# Altium schematic sheet Meter13050.SchDoc
size A4
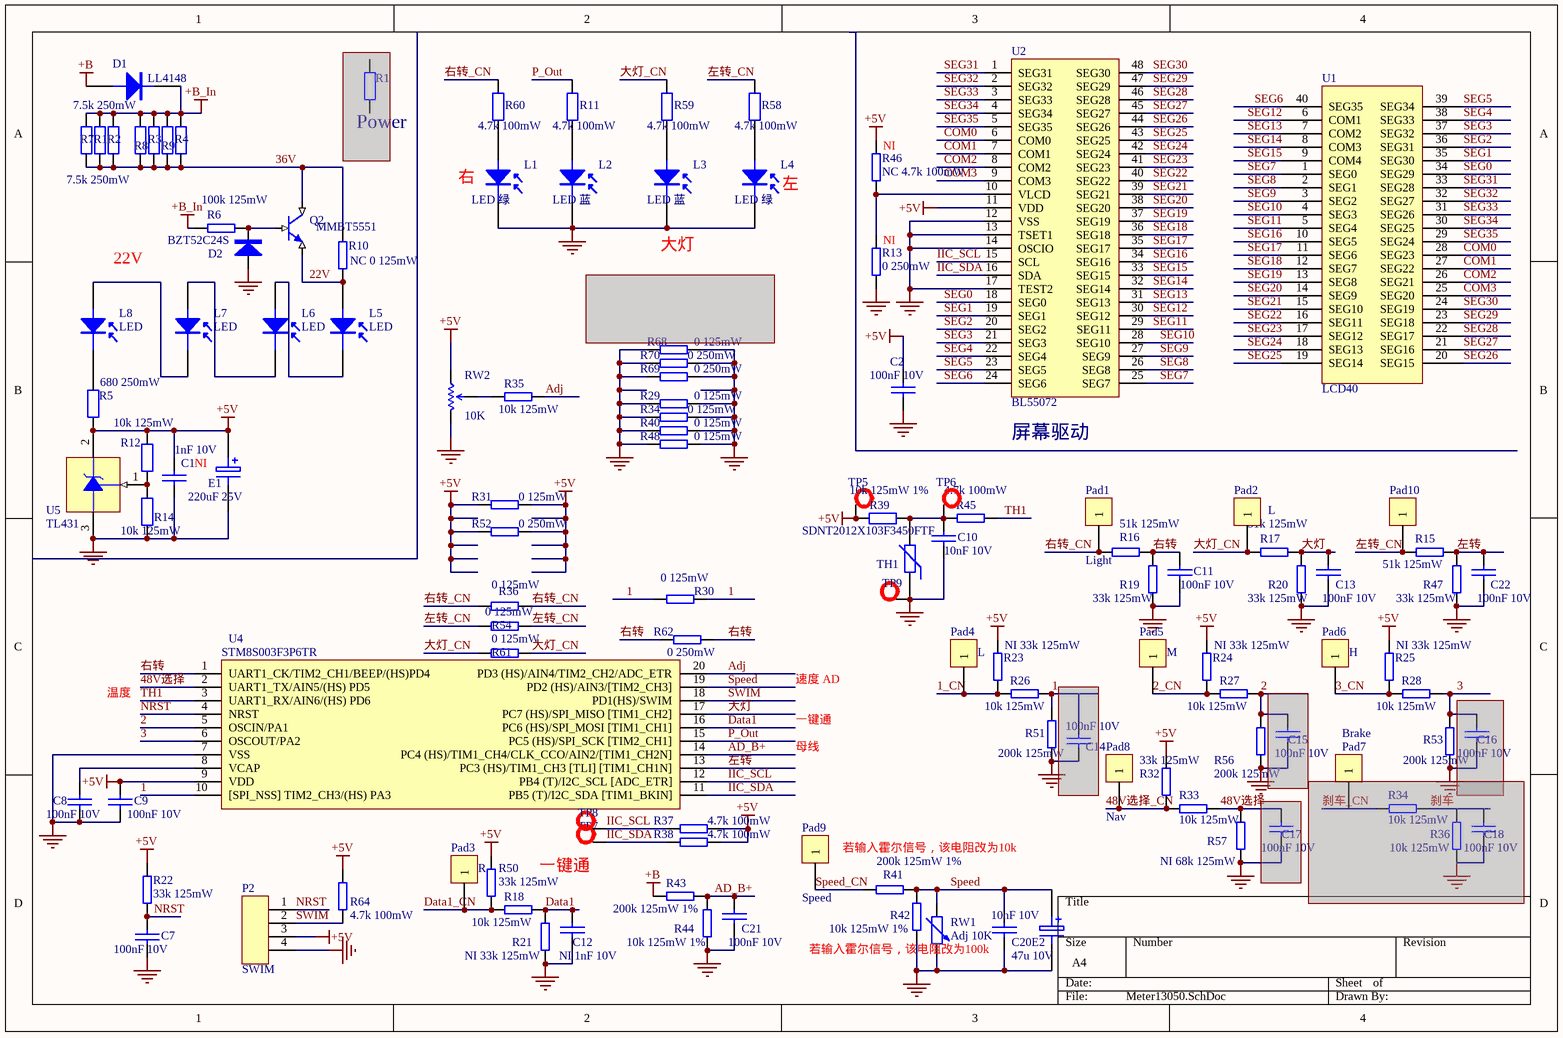
[diagram p0: Meter13050.SchDoc]

## Parts
(Parts that share a designator on the sheet are numbered #1, #2 ... from top to bottom, then left to right.)
C1  1nF 10V  [0805]
C2  100nF 10V  [0603]
C7  100nF 10V  [0805]
C8  100nF 10V  [0603]
C9  100nF 10V  [0603]
C10  10nF 10V  [0603]
C11  100nF 10V  [0603]
C12  NI 1nF 10V  [0805]
C13  100nF 10V  [0603]
C14  100nF 10V  [0805]  (masked out: inside a compile mask, not in the netlist)
C15  100nF 10V  [0805]  (masked out: inside a compile mask, not in the netlist)
C16  100nF 10V  [0805]  (masked out: inside a compile mask, not in the netlist)
C17  100nF 10V  [0805]  (masked out: inside a compile mask, not in the netlist)
C18  100nF 10V  [0603]  (masked out: inside a compile mask, not in the netlist)
C20  10nF 10V  [0603]
C21  100nF 10V  [0603]
C22  100nF 10V  [0603]
D1  LL4148  [MELF-D3516-1406]
D2  BZT52C24S  [SOD-323]
E1  220uF 25V  [RB.1/.2]
E2  47u 10V  [RB.1/.2]
L1  LED 绿  [LED1]
L2  LED 蓝  [LED1]
L3  LED 蓝  [LED1]
L4  LED 绿  [LED1]
L5  LED  [LED1]
L6  LED  [LED1]
L7  LED  [LED1]
L8  LED  [LED1]
P2  SWIM  [SIP4]
Pad1  Light  [PAD]
Pad2  L  [PAD]
Pad3  R  [PAD]
Pad4  L  [PAD]
Pad5  M  [PAD]
Pad6  H  [PAD]
Pad7  Brake  [PAD]  (masked out: inside a compile mask, not in the netlist)
Pad8  Nav  [PAD]
Pad9  Speed  [PAD]
Pad10  (no value)  [PAD]
Q2  MMBT5551  [SOT-23]
R1#1  3.9k 1W  [RES12.5-10.5X3.3]  (value not drawn)  (masked out: inside a compile mask, not in the netlist)
R1#2  7.5k 250mW  [1206]
R2  7.5k 250mW  [1206]  (value not drawn)
R3  7.5k 250mW  [1206]  (value not drawn)
R4  7.5k 250mW  [1206]  (value not drawn)
R5  680 250mW  [1206]
R6  100k 125mW  [0805]
R7  7.5k 250mW  [1206]
R8  7.5k 250mW  [1206]  (value not drawn)
R9  7.5k 250mW  [1206]  (value not drawn)
R10  NC 0 125mW  [0805]
R11  4.7k 100mW  [0603]
R12  10k 125mW  [0805]
R13  0 250mW  [1206]
R14  10k 125mW  [0805]
R15  51k 125mW  [0805]
R16  51k 125mW  [0805]
R17  51k 125mW  [0805]
R18  10k 125mW  [0805]
R19  33k 125mW  [0805]
R20  33k 125mW  [0805]
R21  NI 33k 125mW  [0805]
R22  33k 125mW  [0805]
R23  NI 33k 125mW  [0805]
R24  NI 33k 125mW  [0805]
R25  NI 33k 125mW  [0805]
R26  10k 125mW  [0805]
R27  10k 125mW  [0805]
R28  10k 125mW  [0805]
R29  0 125mW  [0805]
R30  0 125mW  [0805]
R31  0 125mW  [0805]
R32  33k 125mW  [0805]
R33  10k 125mW  [0805]
R34#1  0 125mW  [0805]
R34#2  10k 125mW  [0805]  (masked out: inside a compile mask, not in the netlist)
R35  10k 125mW  [0805]
R36#1  0 125mW  [0805]
R36#2  10k 125mW  [0805]  (masked out: inside a compile mask, not in the netlist)
R37  4.7k 100mW  [0603]
R38  4.7k 100mW  [0603]
R39  10k 125mW 1%  [0805]
R40  0 125mW  [0805]
R41  200k 125mW 1%  [1206]
R42  10k 125mW 1%  [0805]
R43  200k 125mW 1%  [0805]
R44  10k 125mW 1%  [0805]
R45  4.7k 100mW  [0603]
R46  NC 4.7k 100mW  [0603]
R47  33k 125mW  [0805]
R48  0 125mW  [0805]
R50  33k 125mW  [0805]
R51  200k 125mW  [0805]
R52  0 250mW  [1206]
R53  200k 125mW  [0805]
R54  0 125mW  [0805]
R56  200k 125mW  [0805]
R57  NI 68k 125mW  [0805]
R58  4.7k 100mW  [0603]
R59  4.7k 100mW  [0603]
R60  4.7k 100mW  [0603]
R61  0 125mW  [0805]
R62  0 250mW  [1206]
R64  4.7k 100mW  [0603]
R68  0 125mW  [0805]
R69  0 250mW  [1206]
R70  0 250mW  [1206]
RW1  Adj 10K  [ADJRes]
RW2  10K  [RW-3*3SMD]
TH1  SDNT2012X103F3450FTF  [0805]
TP5  (no value)  [PCB_MarkPoint]
TP6  (no value)  [PCB_MarkPoint]
TP7  (no value)  [PCB_MarkPoint]
TP8  (no value)  [PCB_MarkPoint]
TP9  (no value)  [PCB_MarkPoint]
U1  LCD40  [LCD40]
U2  BL55072  [TSSOP-48]
U4  STM8S003F3P6TR  [SSOP20]
U5  TL431  [SOT-23]

## Nets
+5V: C1.1 C2.1 C9.1 E1.1 P2.3 R5.2 R12.1 R22.2 R23.1 R24.1 R25.1 R31.1 R31.2 R32.1 R37.1 R38.1 R39.2 R46.1 R50.1 R52.1 R52.2 R64.1 RW2.2 TP5.1 U2.11(VDD) U4.9(VDD) U5.2(K)
+B: D1.1(A) R43.2
+B_In: D1.2(K) R1#2.2 R2.2 R3.2 R4.2 R6.1 R7.2 R8.2 R9.2
GND: C1.2 C2.2 C7.2 C8.2 C9.2 C10.2 C11.2 C12.2 C13.2 C20.2 C21.2 C22.2 D2.2(A) E1.2 E2.2 L1.K L2.K L3.K L4.K P2.4 R13.2 R14.2 R19.2 R20.2 R21.2 R29.1 R29.2 R34#1.1 R34#1.2 R40.1 R40.2 R42.2 R44.2 R47.2 R48.1 R48.2 R51.2 R53.2 R56.2 R57.2 R68.1 R68.2 R69.1 R69.2 R70.1 R70.2 RW1.2 RW2.1 TH1.1 TP9.1 U2.12(VSS) U2.13(TSET1) U2.14(OSCIO) U2.17(TEST2) U4.7(VSS) U5.3(A)
1: R26.1 R30.1 R30.2 R51.1 U4.10([SPI_NSS]_TIM2_CH3/(HS)_PA3)
1_CN: Pad4.1 R23.2 R26.2
2: R27.1 R56.1 U4.5(OSCIN/PA1)
2_CN: Pad5.1 R24.2 R27.2
3: R28.1 R53.1 U4.6(OSCOUT/PA2)
3_CN: Pad6.1 R25.2 R28.2
22V: L5.A Q2.2(E) R10.2
36V: Q2.3(C) R1#2.1 R2.1 R3.1 R4.1 R7.1 R8.1 R9.1 R10.1
48V选择: R33.1 R57.1 U4.2(UART1_TX/AIN5/(HS)_PD5)
48V选择_CN: Pad8.1 R32.2 R33.2
AD_B+: C21.1 R43.1 R44.1 U4.14(PC4_(HS)/TIM1_CH4/CLK_CCO/AIN2/[TIM1_CH2N])
Adj: R35.1 U4.20(PD3_(HS)/AIN4/TIM2_CH2/ADC_ETR)
COM0: U1.28(SEG23) U2.6(COM0)
COM1: U1.27(SEG22) U2.7(COM1)
COM2: U1.26(SEG21) U2.8(COM2)
COM3: U1.25(SEG20) U2.9(COM3)
Data1: C12.1 R18.1 R21.1 U4.16(PC6_(HS)/SPI_MOSI_[TIM1_CH1])
Data1_CN: Pad3.1 R18.2 R50.2
IIC_SCL: R37.2 TP8.1 U2.15(SCL) U4.12(PB4_(T)/I2C_SCL_[ADC_ETR])
IIC_SDA: R38.2 TP7.1 U2.16(SDA) U4.11(PB5_(T)/I2C_SDA_[TIM1_BKIN])
NRST: C7.1 P2.1 R22.1 U4.4(NRST)
P_Out: R11.2 U4.15(PC5_(HS)/SPI_SCK_[TIM2_CH1])
SEG0: U1.34(SEG29) U2.18(SEG0)
SEG1: U1.35(SEG30) U2.19(SEG1)
SEG2: U1.36(SEG31) U2.20(SEG2)
SEG3: U1.37(SEG32) U2.21(SEG3)
SEG4: U1.38(SEG33) U2.22(SEG4)
SEG5: U1.39(SEG34) U2.23(SEG5)
SEG6: U1.40(SEG35) U2.24(SEG6)
SEG7: U1.1(SEG0) U2.25(SEG7)
SEG8: U1.2(SEG1) U2.26(SEG8)
SEG9: U1.3(SEG2) U2.27(SEG9)
SEG10: U1.4(SEG3) U2.28(SEG10)
SEG11: U1.5(SEG4) U2.29(SEG11)
SEG12: U1.6(COM1) U2.30(SEG12)
SEG13: U1.7(COM2) U2.31(SEG13)
SEG14: U1.8(COM3) U2.32(SEG14)
SEG15: U1.9(COM4) U2.33(SEG15)
SEG16: U1.10(SEG5) U2.34(SEG16)
SEG17: U1.11(SEG6) U2.35(SEG17)
SEG18: U1.12(SEG7) U2.36(SEG18)
SEG19: U1.13(SEG8) U2.37(SEG19)
SEG20: U1.14(SEG9) U2.38(SEG20)
SEG21: U1.15(SEG10) U2.39(SEG21)
SEG22: U1.16(SEG11) U2.40(SEG22)
SEG23: U1.17(SEG12) U2.41(SEG23)
SEG24: U1.18(SEG13) U2.42(SEG24)
SEG25: U1.19(SEG14) U2.43(SEG25)
SEG26: U1.20(SEG15) U2.44(SEG26)
SEG27: U1.21(SEG16) U2.45(SEG27)
SEG28: U1.22(SEG17) U2.46(SEG28)
SEG29: U1.23(SEG18) U2.47(SEG29)
SEG30: U1.24(SEG19) U2.48(SEG30)
SEG31: U1.33(SEG28) U2.1(SEG31)
SEG32: U1.32(SEG27) U2.2(SEG32)
SEG33: U1.31(SEG26) U2.3(SEG33)
SEG34: U1.30(SEG25) U2.4(SEG34)
SEG35: U1.29(SEG24) U2.5(SEG35)
Speed: C20.1 E2.1 R41.1 R42.1 RW1.1 U4.19(PD2_(HS)/AIN3/[TIM2_CH3])
Speed_CN: Pad9.1 R41.2
SWIM: P2.2 R64.2 U4.18(PD1(HS)/SWIM)
TH1: R45.1 U4.3(UART1_RX/AIN6/(HS)_PD6)
右转: C11.1 R16.1 R19.1 R62.1 R62.2 U4.1(UART1_CK/TIM2_CH1/BEEP/(HS)PD4)
右转_CN: Pad1.1 R16.2 R36#1.1 R36#1.2 R60.2
大灯: C13.1 R17.1 R20.1 U4.17(PC7_(HS)/SPI_MISO_[TIM1_CH2])
大灯_CN: Pad2.1 R17.2 R59.2 R61.1 R61.2
左转: C22.1 R15.1 R47.1 U4.13(PC3_(HS)/TIM1_CH3_[TLI]_[TIM1_CH1N])
左转_CN: Pad10.1 R15.2 R54.1 R54.2 R58.2
NetC8_1: C8.1 U4.8(VCAP)
NetC10_1: C10.1 R39.1 R45.2 TH1.2 TP6.1
NetD2_1: D2.1(k) Q2.1(B) R6.2
NetL1_A: L1.A R60.1
NetL2_A: L2.A R11.1
NetL3_A: L3.A R59.1
NetL4_A: L4.A R58.1
NetL5_K: L5.K L6.A
NetL6_K: L6.K L7.A
NetL7_K: L7.K L8.A
NetL8_K: L8.K R5.1
NetR12_2: R12.2 R14.1 U5.1(REF)
NetR13_1: R13.1 R46.2 U2.10(VLCD)
NetR35_2: R35.2 RW2.3

## Notes on the sheet
- (near R1#1) Power
- (near R46) NI
- (near L1) 右
- (near L3) 大灯
- (near L4) 左
- (near R13) NI
- 22V
- (near U2) 屏幕驱动
- NI
- 温度
- 速度 AD
- 一键通
- 母线
- 若输入霍尔信号，该电阻改为10k
- 若输入霍尔信号，该电阻改为100k

## Library data of the parts
C1 C2 C7-C18 C20-C22 = CAP: Capacitor
D1 = DIODE
D2 = ZMM6V8: Diode
E1 = ELECTRO1: Electrolytic Capacitor; Pressure: 25V
E2 = ELECTRO1: Electrolytic Capacitor; Pressure: 25V
L1-L8 = PHOTO: Photosensitive Diode
P2 = CON4
Pad1-Pad10 = CON1: Connector
Q2 = 5551: NPN BJT
R1#1 R1#2 R2-R5 R7-R9 R11 R12 R14 R39 R58-R60 = Res2: Resistor; Published: 8-Jun-2000; LatestRevisionDate: 17-Jul-2002; LatestRevisionNote: Re-released for DXP Platform.; PackageReference: AXIAL-0.4; Publisher: Altium Limited
R6 R10 R13 R15-R33 R34#1 R34#2 R35 R36#1 R36#2 R37 R38 R40-R48 R50-R54 R56 R57 R61 R62 R64 R68-R70 = WHLRES
RW1 = Res Adj2: Variable Resistor; Value: 4.7K; Set Position: 0.5; Published: 8-Jun-2000; LatestRevisionDate: 17-Jul-2002; LatestRevisionNote: Re-released for DXP Platform.; PackageReference: AXIAL-0.6; Publisher: Altium Limited; PackageDescription: Axial Device, Thru-Hole; 2 Leads; 0.6 in Pin Spacing
RW2 = RW1
TH1 = Res Varistor: Varistor (Voltage-Sensitive Resistor); Published: 24-Mar-1999; LatestRevisionDate: 04-Mar-2005; LatestRevisionNote: PCB Footprint replaced.; PackageReference: 6-0805; Publisher: Altium Limited
TP5-TP9 = TEST-1
U4 = STM8S003F3P6
U5 = TL430CLP: Adjustable Shunt Regulator; Published: 15-Apr-2002; DatasheetVersion: Mar-1988; PackageVersion: Nov-2001; PackageReference: LP03; Publisher: Altium Limited; PackageDescription: TO, Flat Index; 3 In-Line, Axial Leads; Body Dia. 4.8mm; Leads 0.56 x 0.41 mm (max); Code_JEDEC: TO-226-AA; ComponentLink1Description: Manufacturer Link; ComponentLink1URL: http://www.ti.com/